# Altium schematic sheet [07] - TEMP, PROXIMITY SENSORS.SchDoc
size A4; DocumentNumber: 7; SheetNumber: 7; SheetTotal: 14
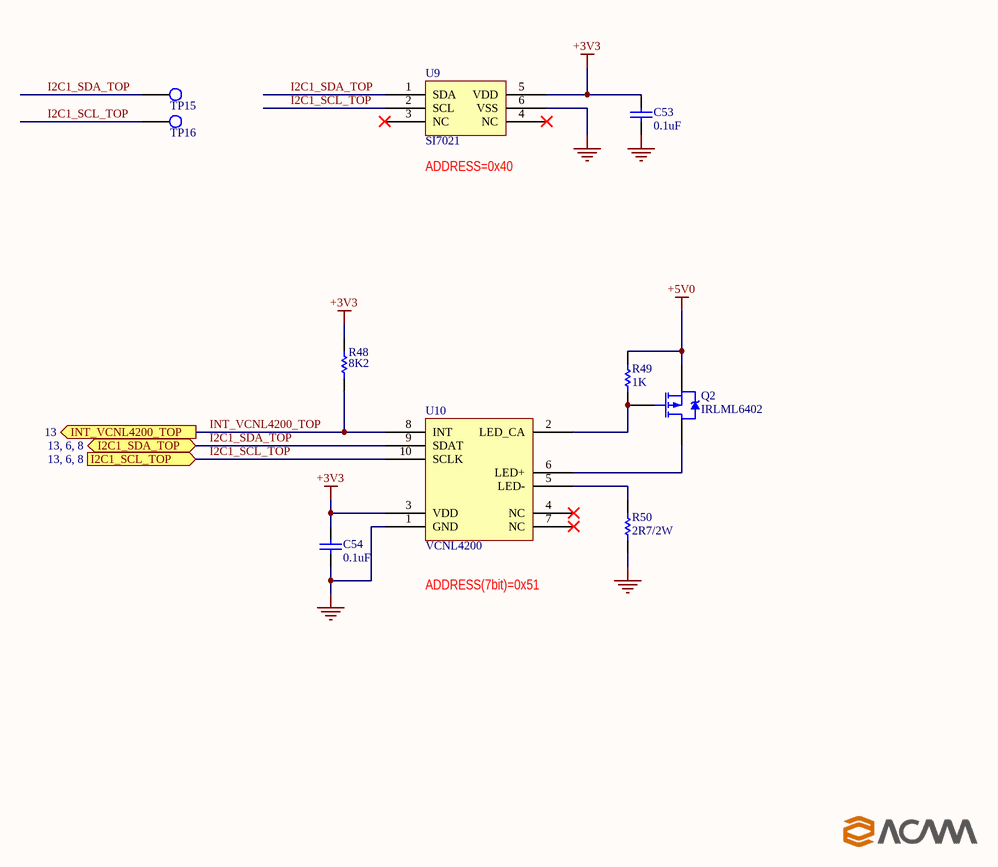
[diagram p0: [07] - TEMP, PROXIMITY SENSORS.SchDoc]

## Parts
C53  0.1uF  [0805_C_AUTO]
C54  0.1uF  [0805_C_AUTO]
Q2  IRLML6402  [SOT23]
R48  8K2  [0805_R_AUTO]
R49  1K  [0805_R_AUTO]
R50  2R7/2W  [2512_R]
TP15  Test Point  [PIN_1mm]  (value not drawn)
TP16  Test Point  [PIN_1mm]  (value not drawn)
U9  SI7021  [DFN-6]
U10  VCNL4200  [VCNL4200]

## Ports
I2C1_SCL_TOP (in, see 13, 6, 8), I2C1_SDA_TOP (bidir, see 13, 6, 8), INT_VCNL4200_TOP (out, see 13)

## Nets
+3V3: C53.2 C54.2 R48.1 U9.5(VDD) U10.3(VDD)
+5V0: Q2.2(S) R49.2
GND: C53.1 C54.1 R50.1 U9.6(VSS) U10.1(GND)
I2C1_SCL_TOP: TP16.1 U9.2(SCL) U10.10(SCLK) ; port I2C1_SCL_TOP
I2C1_SDA_TOP: TP15.1 U9.1(SDA) U10.9(SDAT) ; port I2C1_SDA_TOP
INT_VCNL4200_TOP: R48.2 U10.8(INT) ; port INT_VCNL4200_TOP
NetQ2_1: Q2.1(G) R49.1 U10.2(LED_CA)
NetQ2_3: Q2.3(D) U10.6(LED+)
NetR50_2: R50.2 U10.5(LED-)

Not connected (* = marked no-connect by the designer): U9 3(NC)* 4(NC)*; U10 4(NC)* 7(NC)*

## Notes on the sheet
- (near U9) ADDRESS=0x40
- ADDRESS(7bit)=0x51

## Library data of the parts
C53 C54 = Cap SMD: Non-Pol SMD Capacitor; RATED_VOLTAGE: 16V; Value: 0.1uF; Manufacturer Part Num: *
Q2 = MOSFET P-CH: P-Channel Mosfet; Manufacturer Part Num: IRLML6402TRPBF; Value: IRLML6402
R48 R49 = Res SMD: SMD Resistor; Tolerance: 5%; Manufacturer Part Num: *
  R48: Value: 8K2
  R49: Value: 1K
R50 = Res SMD: SMD Resistor; Manufacturer Part Num: AC2512JK-7W2R7L; Tolerance: 5%; Value: 2R7/2W
TP15 TP16 = Test Point: Test Point Footprint; Value: Test Point
U9 = SI7021: I2C HUMIDITY AND TEMPERATURE SENSOR; Value: SI7021
U10 = VCNL4200: High Sensitivity Long Distance Proximity and Ambient Light Sensor With I2C Interface; Value: VCNL4200